# Altium schematic sheet HF_TUNER.SchDoc: HF Tuner
size A4 portrait; DocumentNumber: 18; Revision: 2.0; SheetNumber: 18; SheetTotal: 18
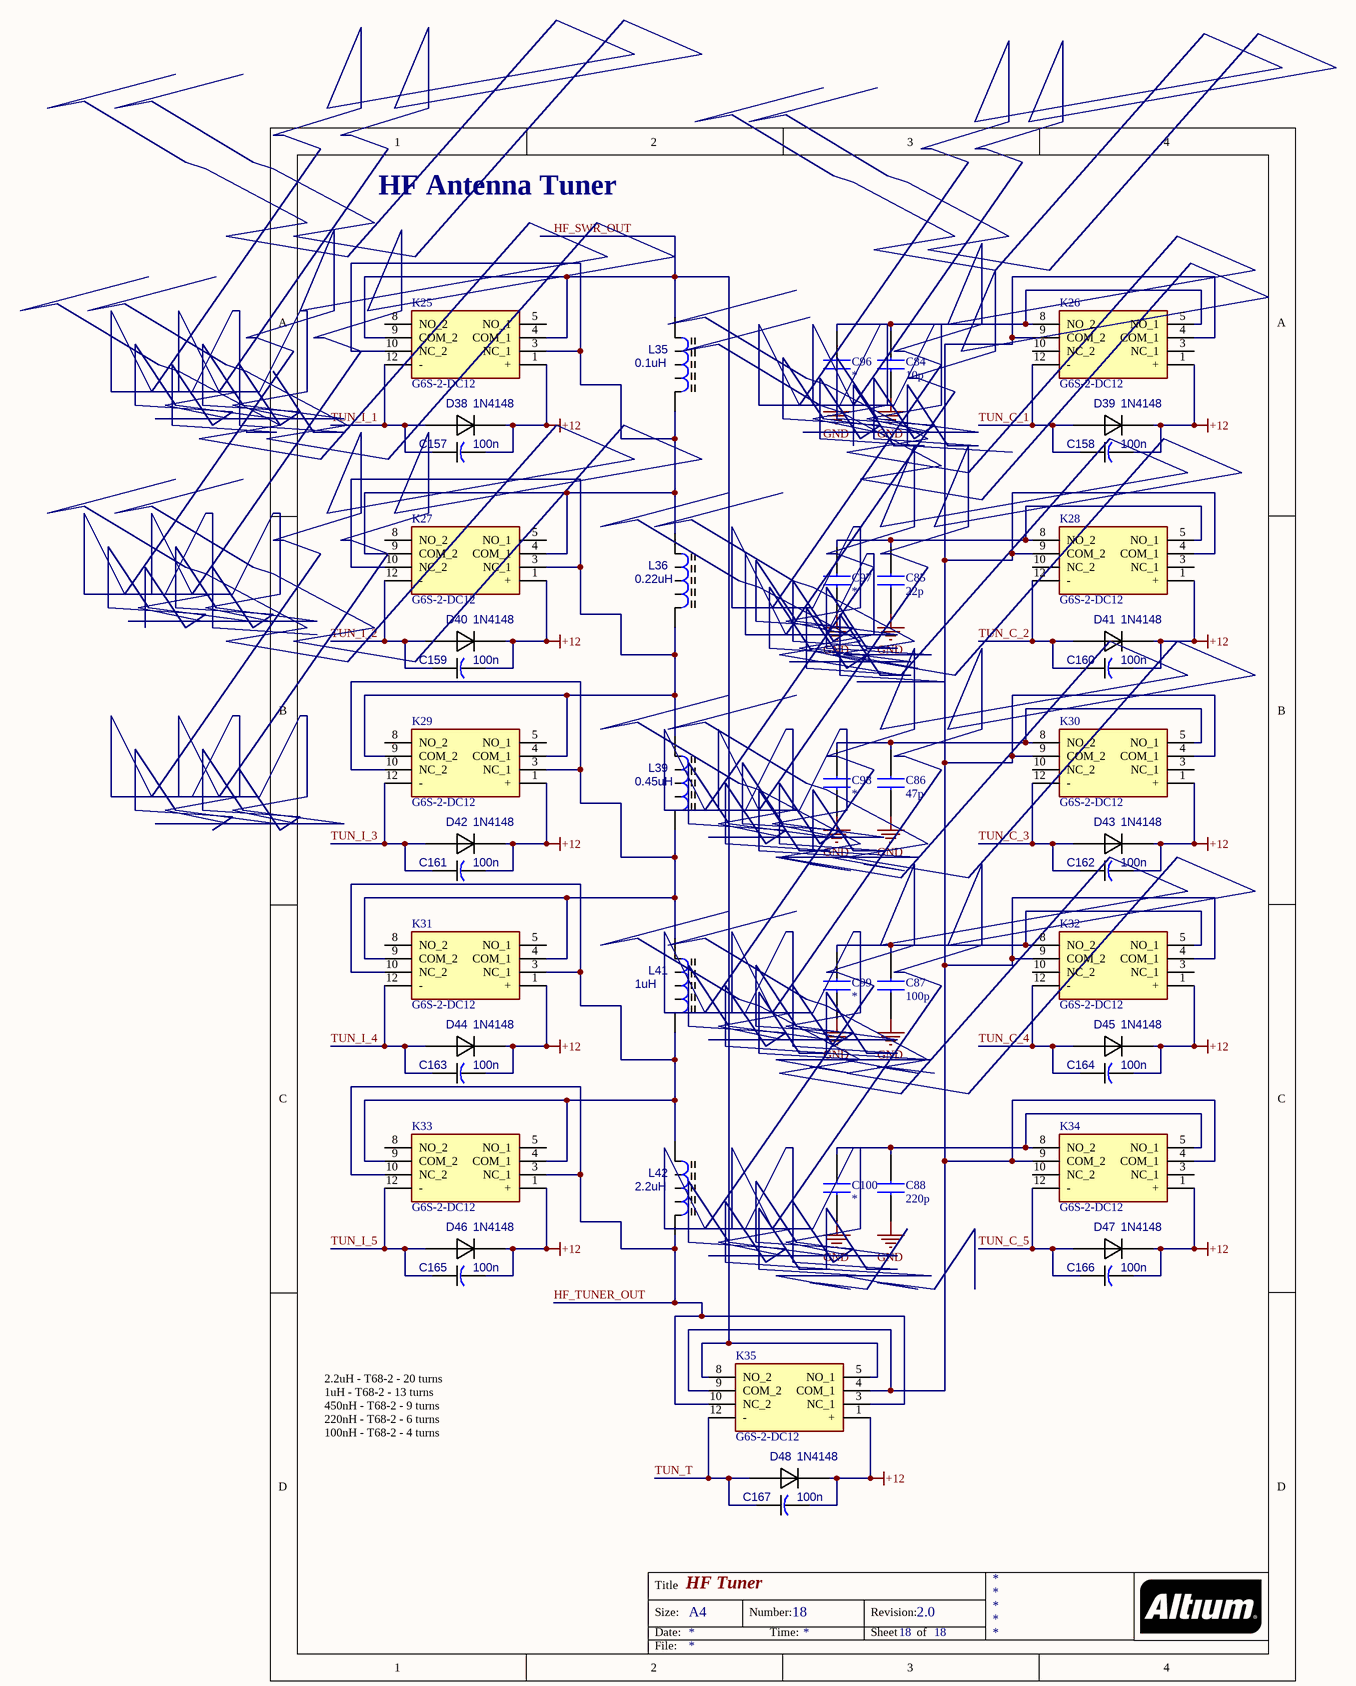
[diagram p0: HF_TUNER.SchDoc]

## Parts
C84  10p  [B32620A0682J000]
C85  22p  [B32620A0682J000]
C86  47p  [B32620A0682J000]
C87  100p  [B32620A0682J000]
C88  220p  [B32620A0682J000]
C96  *  [CAP_1206]
C97  *  [CAP_1206]
C98  *  [CAP_1206]
C99  *  [CAP_1206]
C100  *  [CAP_1206]
C157  100n  [CAP_0805]
C158  100n  [CAP_0805]
C159  100n  [CAP_0805]
C160  100n  [CAP_0805]
C161  100n  [CAP_0805]
C162  100n  [CAP_0805]
C163  100n  [CAP_0805]
C164  100n  [CAP_0805]
C165  100n  [CAP_0805]
C166  100n  [CAP_0805]
C167  100n  [CAP_0805]
D38  1N4148  [SS14]
D39  1N4148  [SS14]
D40  1N4148  [SS14]
D41  1N4148  [SS14]
D42  1N4148  [SS14]
D43  1N4148  [SS14]
D44  1N4148  [SS14]
D45  1N4148  [SS14]
D46  1N4148  [SS14]
D47  1N4148  [SS14]
D48  1N4148  [SS14]
K25  G6S-2-DC12  [G6S2DC12]
K26  G6S-2-DC12  [G6S2DC12]
K27  G6S-2-DC12  [G6S2DC12]
K28  G6S-2-DC12  [G6S2DC12]
K29  G6S-2-DC12  [G6S2DC12]
K30  G6S-2-DC12  [G6S2DC12]
K31  G6S-2-DC12  [G6S2DC12]
K32  G6S-2-DC12  [G6S2DC12]
K33  G6S-2-DC12  [G6S2DC12]
K34  G6S-2-DC12  [G6S2DC12]
K35  G6S-2-DC12  [G6S2DC12]
L35  0.1uH  [IND_FERRITE_CORE_1]
L36  0.22uH  [IND_FERRITE_CORE_1]
L39  0.45uH  [IND_FERRITE_CORE_1]
L41  1uH  [IND_FERRITE_CORE_1]
L42  2.2uH  [IND_FERRITE_CORE_1]

## Nets
HF_SWR_OUT: C84.1 C84.2 C85.1 C86.1 C87.1 C87.2 C88.1 C88.2 C96.1 C96.2 C97.1 C98.1 C99.1 C99.2 C100.1 C100.2 C157.1 C157.2 C158.2 C159.2 C160.2 C161.2 C162.2 C163.2 C164.2 C165.2 C166.2 C167.2 D38.1(K) D38.2(A) D39.1(K) D40.1(K) D41.1(K) D42.1(K) D43.1(K) D44.1(K) D45.1(K) D46.1(K) D47.1(K) D48.1(K) K25.1(+) K25.3(NC_1) K25.4(COM_1) K25.9(COM_2) K25.10(NC_2) K25.12(-) K26.1(+) K26.4(COM_1) K26.5(NO_1) K26.8(NO_2) K26.9(COM_2) K27.1(+) K27.3(NC_1) K27.4(COM_1) K27.9(COM_2) K27.10(NC_2) K28.1(+) K28.4(COM_1) K28.9(COM_2) K29.1(+) K29.4(COM_1) K29.9(COM_2) K30.1(+) K30.4(COM_1) K30.9(COM_2) K31.1(+) K32.1(+) K32.4(COM_1) K32.5(NO_1) K32.8(NO_2) K32.9(COM_2) K33.1(+) K34.1(+) K34.4(COM_1) K34.5(NO_1) K34.8(NO_2) K34.9(COM_2) K35.1(+) K35.4(COM_1) K35.5(NO_1) K35.8(NO_2) K35.9(COM_2) L35.1(A) L35.2(B) L36.1(A) L36.2(B) L39.1(A)  [also labelled +12, GND, TUN_I_1]
HF_TUNER_OUT: K33.3(NC_1) K33.10(NC_2) K35.3(NC_1) K35.10(NC_2) L42.2(B)
TUN_I_2: C159.1 D40.2(A) K27.12(-)
TUN_I_3: C161.1 D42.2(A) K29.12(-)
TUN_I_4: C163.1 D44.2(A) K31.12(-)
TUN_I_5: C165.1 D46.2(A) K33.12(-)
TUN_T: C167.1 D48.2(A) K35.12(-)
TUN_С_1: C158.1 D39.2(A) K26.12(-)
TUN_С_2: C160.1 D41.2(A) K28.12(-)
TUN_С_3: C162.1 D43.2(A) K30.12(-)
TUN_С_4: C164.1 D45.2(A) K32.12(-)
TUN_С_5: C166.1 D47.2(A) K34.12(-)
NetC85_2: C85.2 C97.2 K28.5(NO_1) K28.8(NO_2)
NetC86_2: C86.2 C98.2 K30.5(NO_1) K30.8(NO_2)
NetK29_3: K29.3(NC_1) K29.10(NC_2) K31.4(COM_1) K31.9(COM_2) L39.2(B) L41.1(A)
NetK31_3: K31.3(NC_1) K31.10(NC_2) K33.4(COM_1) K33.9(COM_2) L41.2(B) L42.1(A)

Not connected (* = marked no-connect by the designer): K25 5(NO_1) 8(NO_2); K26 3(NC_1) 10(NC_2); K27 5(NO_1) 8(NO_2); K28 3(NC_1) 10(NC_2); K29 5(NO_1) 8(NO_2); K30 3(NC_1) 10(NC_2); K31 5(NO_1) 8(NO_2); K32 3(NC_1) 10(NC_2); K33 5(NO_1) 8(NO_2); K34 3(NC_1) 10(NC_2)

## Notes on the sheet
- HF Antenna Tuner
- 2.2uH - T68-2 - 20 turns
  1uH - T68-2 - 13 turns
  450nH - T68-2 - 9 turns
  220nH - T68-2 - 6 turns
  100nH - T68-2 - 4 turns
- Title
- Size:
- Date:
- A4
- Number:
- Time:
- Revision:
- Sheet
- of
- File:

## Library data of the parts
C84-C88 = B32620A0682J000: Capacitor; Manufacturer_Name: TDK; Datasheet Link: https://www.tdk-electronics.tdk.com/inf/20/20/db/fc_2009/MKP_B32620_621.pdf; Height: 12mm; Manufacturer_Part_Number: B32620A0682J000; Mouser Part Number: 871-B32620A682J; Mouser Price/Stock: https://www.mouser.com/Search/Refine.aspx?Keyword=871-B32620A682J
C96-C100 = B32620A0682J000: Capacitor NP0 HiVolt; Manufacturer_Name: TDK; Datasheet Link: https://www.tdk-electronics.tdk.com/inf/20/20/db/fc_2009/MKP_B32620_621.pdf; Height: 12mm; Manufacturer_Part_Number: B32620A0682J000; Mouser Part Number: 871-B32620A682J; Mouser Price/Stock: https://www.mouser.com/Search/Refine.aspx?Keyword=871-B32620A682J
C157-C167 = CAP_0805
K25-K35 = G6S-2-DC12: Relay or Contactor; Manufacturer_Name: Omron Electronics; Datasheet Link: https://componentsearchengine.com/Datasheets/1/G6S-2-DC12.pdf; Height: 9.4mm; Manufacturer_Part_Number: G6S-2-DC12; Mouser Part Number: 653-G6S-2-DC12A; Mouser Price/Stock: https://www.mouser.co.uk/ProductDetail/Omron-Electronics/G6S-2-DC12/?qs=QGk6feVlqMLN9Ouv0QsFzA%3D%3D
L35 L36 L39 L41 L42 = IND_FERRITE_CORE: Inductor
D38-D48 = 1N4148: Value: *